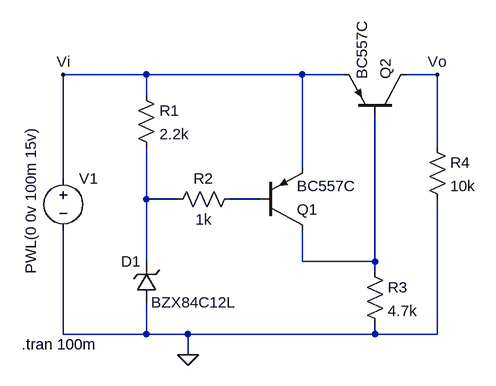
[diagram p0: schematic PNP.asc]
PNP.asc, the LTspice schematic file:
Version 4
SHEET 1 880 680
WIRE 64 -32 -64 -32
WIRE 304 -32 64 -32
WIRE 368 -32 304 -32
WIRE 512 -32 464 -32
WIRE 64 0 64 -32
WIRE 512 80 512 -32
WIRE 304 112 304 -32
WIRE -64 128 -64 -32
WIRE 64 160 64 80
WIRE 112 160 64 160
WIRE 240 160 192 160
WIRE 64 256 64 160
WIRE 304 256 304 208
WIRE 416 256 416 32
WIRE 416 256 304 256
WIRE 416 272 416 256
WIRE -64 368 -64 208
WIRE 64 368 64 320
WIRE 64 368 -64 368
WIRE 128 368 64 368
WIRE 416 368 416 352
WIRE 416 368 128 368
WIRE 512 368 512 160
WIRE 512 368 416 368
WIRE 128 400 128 368
FLAG 512 -32 Vo
FLAG -64 -32 Vi
FLAG 128 400 0
SYMBOL voltage -64 112 R0
WINDOW 3 -50 -64 VRight 2
WINDOW 123 0 0 Left 0
WINDOW 39 0 0 Left 0
SYMATTR InstName V1
SYMATTR Value PWL(0 0v 100m 15v)
SYMBOL res 48 -16 R0
SYMATTR InstName R1
SYMATTR Value 2.2k
SYMBOL res 208 144 R90
WINDOW 0 0 56 VBottom 2
WINDOW 3 32 56 VTop 2
SYMATTR InstName R2
SYMATTR Value 1k
SYMBOL zener 80 320 R180
WINDOW 0 24 64 Left 2
WINDOW 3 -122 1 Left 2
SYMATTR InstName D1
SYMATTR Value BZX84C12L
SYMBOL pnp 240 208 M180
SYMATTR InstName Q1
SYMATTR Value BC557C
SYMBOL pnp 464 32 M270
SYMATTR InstName Q2
SYMATTR Value BC557C
SYMBOL res 400 256 R0
SYMATTR InstName R3
SYMATTR Value 4.7k
SYMBOL res 496 64 R0
SYMATTR InstName R4
SYMATTR Value 10k
TEXT -128 384 Left 2 !.tran 100m

The netlist it stands for:
* PNP.asc
V1 Vi 0 PWL(0 0v 100m 15v)
R1 Vi N001 2.2k
R2 N002 N001 1k
D1 0 N001 BZX84C12L
Q1 N003 N002 Vi 0 BC557C
Q2 Vo N003 Vi 0 BC557C
R3 N003 0 4.7k
R4 Vo 0 10k
.model D D
.lib standard.dio
.model NPN NPN
.model PNP PNP
.lib standard.bjt
.tran 100m
.backanno
.end